# EAGLE schematic NCP3063-converter (EAGLE 7.2.0)
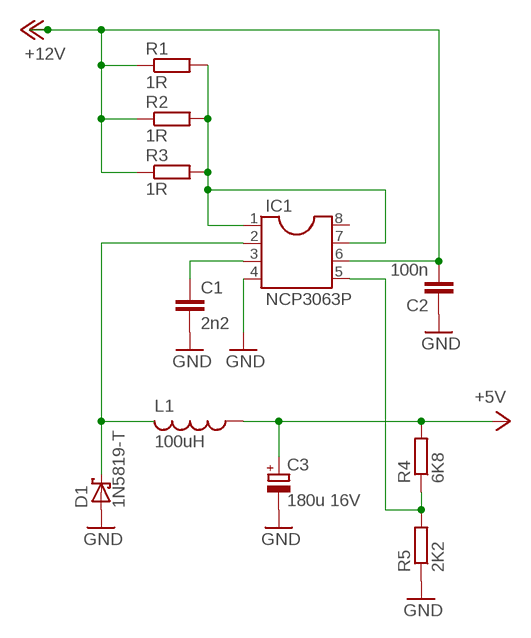
[diagram p0: schematic, sheet 1]

## Parts
C1  2n2  C-EU050-045X075  [C050-045X075]
C2  100n  C-EU050-045X075  [C050-045X075]
C3  180u 16V  CPOL-EUE5-9VAXIAL  [E5R]
D1  1N5819-T  [DO41-7.6]
IC1  NCP3063P  DIL8  [DIL08]
L1  100uH  L-US0207/15  [0207/15]
R1  1R  R-EU_0309/12  [0309/12]
R2  1R  R-EU_0309/12  [0309/12]
R3  1R  R-EU_0309/12  [0309/12]
R4  6K8  R-EU_0309/12  [0309/12]
R5  2K2  R-EU_0309/12  [0309/12]

## Nets
+5V: C3.+ L1.1 R4.2
+12V: C2.2 R1.1 R2.1 R3.1
GND: C1.2 C2.1 C3.- D1.A IC1.4 R5.1
N$2: IC1.1 IC1.7 R1.2 R2.2 R3.2
N$5: C1.1
N$6: D1.C
N$8: R4.1 R5.2
Unconnected: IC1.2 IC1.3 IC1.5 IC1.6 IC1.8 L1.2

## Library data of the parts
C1 C2 = rcl:C-EU: CAPACITOR, European symbol
C3 = rcl:CPOL-EU: POLARIZED CAPACITOR, European symbol
D1 = diode:1N581*: 1.0A SCHOTTKY BARRIER RECTIFIER Source: http://www.diodes.com/datasheets/ds23001.pdf
IC1 = ic-package:DIL8: Dual In Line / Socket
L1 = rcl:L-US: INDUCTOR, American symbol
R1-R5 = resistor:R-EU_: RESISTOR, European symbol